# EAGLE design can-hat (EAGLE 9.6.2)
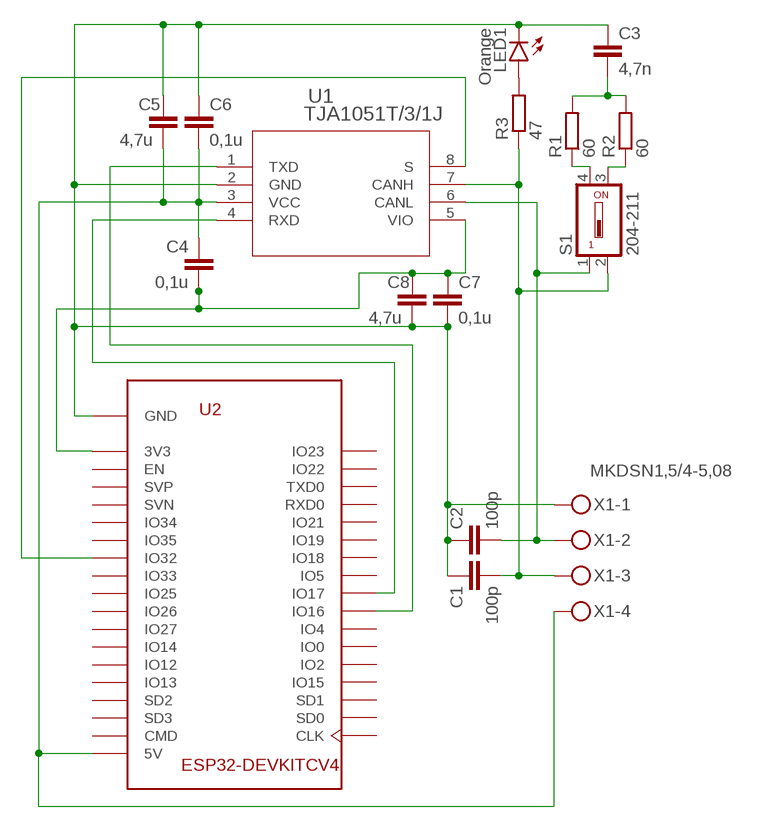
[diagram p0: schematic, sheet 1]

## Parts
C1  100p  C-EUC0603  [C0603]
C2  100p  C-EUC0603  [C0603]
C3  4,7n  C-EUC0603  [C0603]
C4  0,1u  C-EUC0603  [C0603]
C5  4,7u  C-EUC0603  [C0603]
C6  0,1u  C-EUC0603  [C0603]
C7  0,1u  C-EUC0603  [C0603]
C8  4,7u  C-EUC0603  [C0603]
LED1  Orange  LEDCHIP-LED0603  [CHIP-LED0603]
R1  60  R-EU_R0603  [R0603]
R2  60  R-EU_R0603  [R0603]
R3  47  R-EU_R0603  [R0603]
S1  204-211  [204-211ST]
U1  TJA1051T/3/1J  [SO8_SOT96-1_NXP]
U2  ESP32-DEVKITCV4  [DEVKIT-C]
X1  MKDSN1,5/4-5,08  [MKDSN1,5/4-5,08]

## Nets
CANH: C1.1 R3.1 S1.2 U1.7(CANH) X1.3
CANL: C2.2 S1.1 U1.6(CANL) X1.2
GND: C1.2 C2.1 C3.1 C5.1 C6.1 C7.2 C8.2 LED1.C U1.2(GND) U2.GND1(GND) U2.GND2(GND) U2.GND3(GND) X1.1
LED1: LED1.A R3.2
N$3: R2.1 S1.3
N$6: R1.1 S1.4
N$7: C3.2 R1.2 R2.2
RXD: U1.4(RXD) U2.IO17
S: U1.8(S) U2.IO32
TXD: U1.1(TXD) U2.IO16
VCC: C4.1 C5.2 C6.2 U1.3(VCC) U2.5V X1.4
VIO: C4.2 C7.1 C8.1 U1.5(VIO) U2.3V3
Unconnected: U2.CLK U2.CMD U2.EN U2.IO0 U2.IO2 U2.IO4 U2.IO5 U2.IO12 U2.IO13 U2.IO14 U2.IO15 U2.IO18 U2.IO19 U2.IO21 U2.IO22 U2.IO23 U2.IO25 U2.IO26 U2.IO27 U2.IO33 U2.IO34 U2.IO35 U2.RXD0 U2.SD0 U2.SD1 U2.SD2 U2.SD3 U2.SVN U2.SVP U2.TXD0

## Library data of the parts
C1-C8 = rcl:C-EU: CAPACITOR, European symbol; SPICEPREFIX: C
LED1 = led:LED: LED OSRAM: - CHIPLED LG R971, LG N971, LY N971, LG Q971, LY Q971, LO R971, LY R971 LH N974, LH R974 LS Q976, LO Q976, LY Q976 LO Q996 - Hyper CHIPLED LW Q18S LB Q993, LB Q99A, LB R99A - SideLED LS A670, LO A670, LY A670, LG A670, LP A670 LB A673, LV A673, LT A673, LW A673 LH A674 LY A675 LS A676, LA A676, LO A676, LY A676, LW A676 LS A679, LY A679, LG A679 - Hyper Micro SIDELED® LS Y876, LA Y876, LO Y876, LY Y876 LT Y87S - SmartLED LW L88C, LW L88S LB L89C, LB L89S, LG L890 LS L89K, LO L89K, LY L89K LS L896, LA L896, LO L896, LY L896 - TOPLED LS T670, LO T670, LY T670, LG T670, LP T670 LSG T670, LSP T670, LSY T670, LOP T670, LYG T670 LG T671, LOG T671, LSG T671 LB T673, LV T673, LT T673, LW T673 LH T674 LS T676, LA T676, LO T676, LY T676, LB T676, LH T676, LSB T676, LW T676 LB T67C, LV T67C, LT T67C, LS T67K, LO T67K, LY T67K, LW E67C LS E67B, LA E67B, LO E67B, LY E67B, LB E67C, LV E67C, LT E67C LW T67C LS T679, LY T679, LG T679 LS T770, LO T770, LY T770, LG T770, LP T770 LB T773, LV T773, LT T773, LW T773 LH T774 LS E675, LA E675, LY E675, LS T675 LS T776, LA T776, LO T776, LY T776, LB T776 LHGB T686 LT T68C, LB T68C - Hyper Mini TOPLED® LB M676 - Mini TOPLED Santana® LG M470 LS M47K, LO M47K, LY M47K Source: http://www.osram.convergy.de LUXEON: - LUMILED® LXK2-PW12-R00, LXK2-PW12-S00, LXK2-PW14-U00, LXK2-PW14-V00 LXK2-PM12-R00, LXK2-PM12-S00, LXK2-PM14-U00 LXK2-PE12-Q00, LXK2-PE12-R00, LXK2-PE12-S00, LXK2-PE14-T00, LXK2-PE14-U00 LXK2-PB12-K00, LXK2-PB12-L00, LXK2-PB12-M00, LXK2-PB14-N00, LXK2-PB14-P00, LXK2-PB14-Q00 LXK2-PR12-L00, LXK2-PR12-M00, LXK2-PR14-Q00, LXK2-PR14-R00 LXK2-PD12-Q00, LXK2-PD12-R00, LXK2-PD12-S00 LXK2-PH12-R00, LXK2-PH12-S00 LXK2-PL12-P00, LXK2-PL12-Q00, LXK2-PL12-R00 Source: www.luxeon.com KINGBRIGHT: KA-3528ASYC Source: www.kingbright.com
R1-R3 = rcl:R-EU_: RESISTOR, European symbol; SPICEPREFIX: R
S1 = dpst:204-211*: Surface Mount DIP Switch Series 204 SMT CTS Electronic Components Sourc: www.ctscorp.com; OC_FARNELL: unknown; OC_NEWARK: unknown
U1 = TJA1051:TJA1051T/3/1J; BUILT_BY: EMA_Cory; COPYRIGHT: Copyright (C) 2018 Accelerated Designs. All rights reserved; DATASHEET: https://www.nxp.com/docs/en/data-sheet/TJA1051.pdf; MANUFACTURER_PART_NUMBER: TJA1051T/3/1J; SOURCELIBRARY: NXP_2020-10-08; VENDOR: NXP
U2 = esp32-devkit-v4:ESP32-DEVKITC
X1 = con-phoenix-508:MKDSN1,5/4-5,08: MKDSN 1,5/ 4-5,08 Printklemme Nennstrom: 13,5 A Nennspannung: 250 V Rastermaß: 5,08 mm Polzahl: 4 Anschlussart: Schraubanschluss Montage: Löten Anschlussrichtung Leiter/Platine: 0 ° Artikelnummer: 1729144 Source: http://eshop.phoenixcontact.com .. 1729144.pdf

## Board
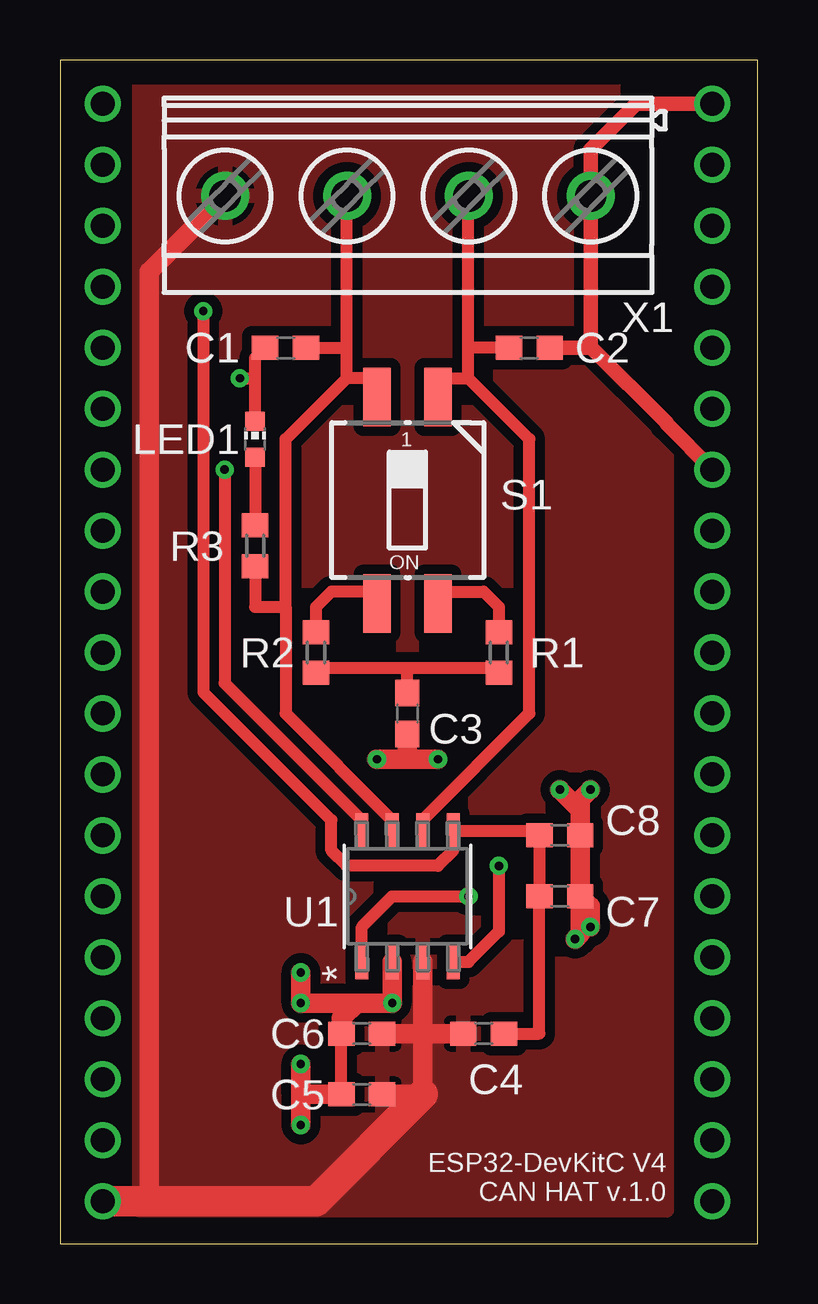
[diagram p1: board, top side]
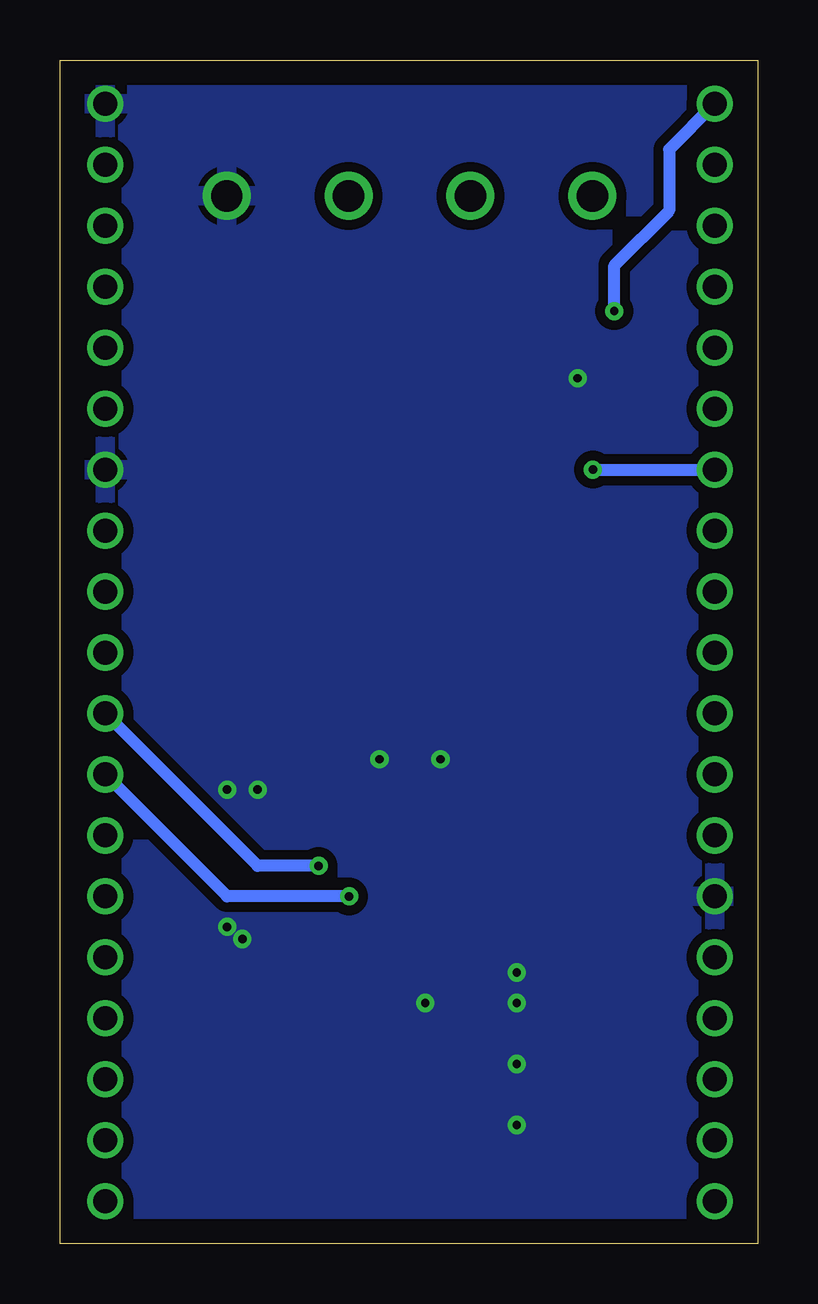
[diagram p2: board, bottom side, seen from below]

Size 29.06 x 49.33 mm. Coordinates in mm from the lower left corner, seen from the top.
Outline: 0,0 29.06,0 29.06,49.33 0,49.33 0,0
Copper layers (1*16): Top 0.035mm / dielectric 1.5mm / Bottom 0.035mm
Design rules "default": minimum track width 6mil, minimum drill 0.35mm, track to track 6mil, track to pad 6mil, pad to pad 6mil, via to via 6mil, smd to smd 6mil, copper to edge 40mil, drill to drill 6mil, minimum pad ring 10mil, minimum via ring 8mil, stop-mask expansion 4mil, vias tented up to drill 0mil, thermal gap 10mil

### Footprints (pad centres in the part's own frame; a part is rotated, then mirrored left to right if it is on the bottom)
C0603 = smd 1.1 x 1: 1 -0.85,0; 2 0.85,0
CHIP-LED0603 = smd 0.8 x 0.8: A 0,-0.75; C 0,0.75
R0603 = smd 1 x 1.1: 1 -0.85,0; 2 0.85,0
204-211ST = smd 1.13 x 2.44: 1 -1.27,-4.3; 2 1.27,-4.3; 3 1.27,4.3; 4 -1.27,4.3
SO8_SOT96-1_NXP = smd 1.46 x 0.533: 1 -2.724,1.905; 2 -2.724,0.635; 3 -2.724,-0.635; 4 -2.724,-1.905; 5 2.724,-1.905; 6 2.724,-0.635; 7 2.724,0.635; 8 2.724,1.905
DEVKIT-C = drill 1: 3V3 -12.7,22.86; 5V -12.7,-22.86; CLK 12.7,-22.86; CMD -12.7,-20.32; EN -12.7,20.32; GND1 -12.7,-10.16; GND2 12.7,7.62; GND3 12.7,22.86; IO0 12.7,-10.16; IO2 12.7,-12.7; IO4 12.7,-7.62; IO5 12.7,0; IO12 -12.7,-7.62; IO13 -12.7,-12.7; IO14 -12.7,-5.08; IO15 12.7,-15.24; IO16 12.7,-5.08; IO17 12.7,-2.54; IO18 12.7,2.54; IO19 12.7,5.08; IO21 12.7,10.16; IO22 12.7,17.78; IO23 12.7,20.32; IO25 -12.7,2.54; IO26 -12.7,0; IO27 -12.7,-2.54; IO32 -12.7,7.62; IO33 -12.7,5.08; IO34 -12.7,12.7; IO35 -12.7,10.16; RXD0 12.7,12.7; SD0 12.7,-20.32; SD1 12.7,-17.78; SD2 -12.7,-15.24; SD3 -12.7,-17.78; SVN -12.7,15.24; SVP -12.7,17.78; TXD0 12.7,15.24
MKDSN1,5/4-5,08 = drill 1.3 pad 2: 1 -7.641,0.025; 2 -2.561,0.025; 3 2.519,0.025; 4 7.599,0.025

### Placement (x,y rotation side)
C1  9.4,37.34 180 top
C2  19.56,37.34 180 top
C3  14.48,22.1 90 top
C4  17.65,8.76 0 top
C5  12.57,6.22 0 top
C6  12.57,8.76 0 top
C7  20.83,14.48 0 top
C8  20.83,17.02 0 top
LED1  8.13,33.53 0 top
R1  18.29,24.64 270 top
R2  10.67,24.64 270 top
R3  8.13,29.08 90 top
S1  14.48,30.99 180 top
U1  14.48,14.48 90 top
U2  14.48,24.64 0 top
X1  14.48,43.69 180 top

### Tracks (layer width: path | path; a pad name or v marks a point on that pad's centre or on a via)
CANH
  Top 0.508: U1.7 13.84,17.65 9.4,22.1 9.4,26.54 | 9.4,26.54 9.4,33.53 11.94,36.07 | R3.1 8.13,26.54 9.4,26.54 | 11.94,36.07 11.94,37.34 | 11.94,36.07 13.21,36.07 S1.2 | C1.1 11.94,37.34 | 11.94,37.34 11.94,43.64 X1.3
CANL
  Top 0.508: U1.6 15.11,17.65 19.56,22.1 19.56,33.53 17.02,36.07 | 17.02,36.07 17.02,37.34 | 17.02,36.07 15.75,36.07 S1.1 | C2.2 17.02,37.34 | 17.02,37.34 17.02,43.64 X1.2
GND  (via drill 0.35)
  Top 0.508: C5.1 C6.1 | LED1.C 8.13,36.07 | 8.13,36.07 8.13,36.92 C1.2 | v7.49,36.07 8.13,36.07
  Top 0.61: C2.1 22.1,37.34 22.12,37.36 | 22.12,37.36 X1.1 22.12,45.57 22.1,45.59 24,47.5 U2.GND3 | 22.12,37.36 25.27,34.2 25.27,34.16 U2.GND2
  Top 0.813: U1.2 v13.84,10.03 12.36,10.03 | C6.1 11.72,9.4 12.36,10.03 | C3.1 14.48,20.19 | 14.48,20.19 v13.21,20.19 | 14.48,20.19 v15.75,20.19 | 12.36,10.03 v10.03,10.03 v10.03,11.3 | C5.1 10.03,6.22 | 10.03,6.22 v10.03,7.49 | 10.03,6.22 v10.03,4.95 | C8.2 C7.2 | C8.2 21.68,18.5 v22.1,18.92 | C7.2 22.1,14.06 v22.1,13.21 | C7.2 21.68,12.92 v21.46,12.7 | C8.2 21.68,18.07 v20.83,18.92
  pour Bottom (isolate 0.406): 0.51,48.77 0.51,0.51 28.45,0.51 28.45,48.77
LED1
  Top 0.508: LED1.A R3.2
N$3
  Top 0.508: R2.1 10.67,26.54 11.3,27.18 13.21,27.18 S1.3
N$6
  Top 0.508: S1.4 16.24,27.18 17.65,27.18 18.29,26.54 R1.1
N$7
  Top 0.508: C3.2 14.48,24 | 14.48,24 10.88,24 R2.2 | 14.48,24 18.07,24 R1.2
RXD  (via drill 0.35)
  Top 0.508: U1.4 17.02,11.75 18.29,13.02 v18.29,15.75
  Bottom 0.508: v18.29,15.75 20.83,15.75 U2.IO17
S  (via drill 0.35)
  Top 0.508: v6.86,32.26 6.86,23.37 12.57,17.65 U1.8
  Bottom 0.508: v6.86,32.26 U2.IO32
TXD  (via drill 0.35)
  Top 0.508: U1.1 12.57,13.21 13.84,14.48 v17.02,14.48
  Bottom 0.508: v17.02,14.48 22.1,14.48 U2.IO16
VCC
  Top 0.813: 15.11,8.76 15.11,6.22 C5.2 | 15.11,8.76 U1.3 | C6.2 15.11,8.76 | 15.11,8.76 C4.1 | X1.4 3.73,40.51 3.73,1.78
  Top 1.27: U2.5V 3.73,1.78 10.67,1.78 15.11,6.22
  pour Top (isolate 0.406): 3.3,48.77 25.27,48.77 25.27,1.4 3.3,1.4
VIO  (via drill 0.35)
  Top 0.508: C4.2 19.98,8.76 C7.1 C8.1 19.79,17.2 U1.5 16.38,16.38 15.75,15.75 11.94,15.75 11.3,16.38 11.3,17.65 5.97,22.99 v5.97,38.86
  Bottom 0.508: v5.97,38.86 5.97,40.77 3.68,43.05 3.68,45.59 U2.3V3

### Text on the board
tPlace: ESP32-DevKitC V4 / CAN HAT v.1.0